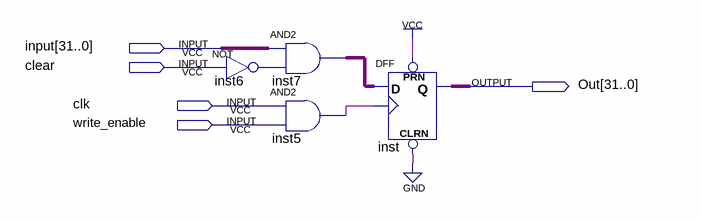
[diagram p0: schematic sheet]
// Quartus schematic register_32_bit.bdf as structural Verilog: 4 symbols, 5 pins
module register_32_bit (
  input  [31:0] \input ,
  input  clear,
  input  clk,
  input  write_enable,
  output [31:0] Out
);

  wire inst5_out, inst6_out;
  wire [31:0] inst7_out;

  not inst6 (inst6_out, clear);
  assign inst7_out = \input  & {32{inst6_out}};  // AND2 inst7, 32 bits wide
  and inst5 (inst5_out, clk, write_enable);
  DFF inst[31:0] (.CLRN(1'b0), .CLK(inst5_out), .D(inst7_out), .PRN(1'b1), .Q(Out));
endmodule
